# EAGLE design FORCE2_1_3 (EAGLE 9.3.0)
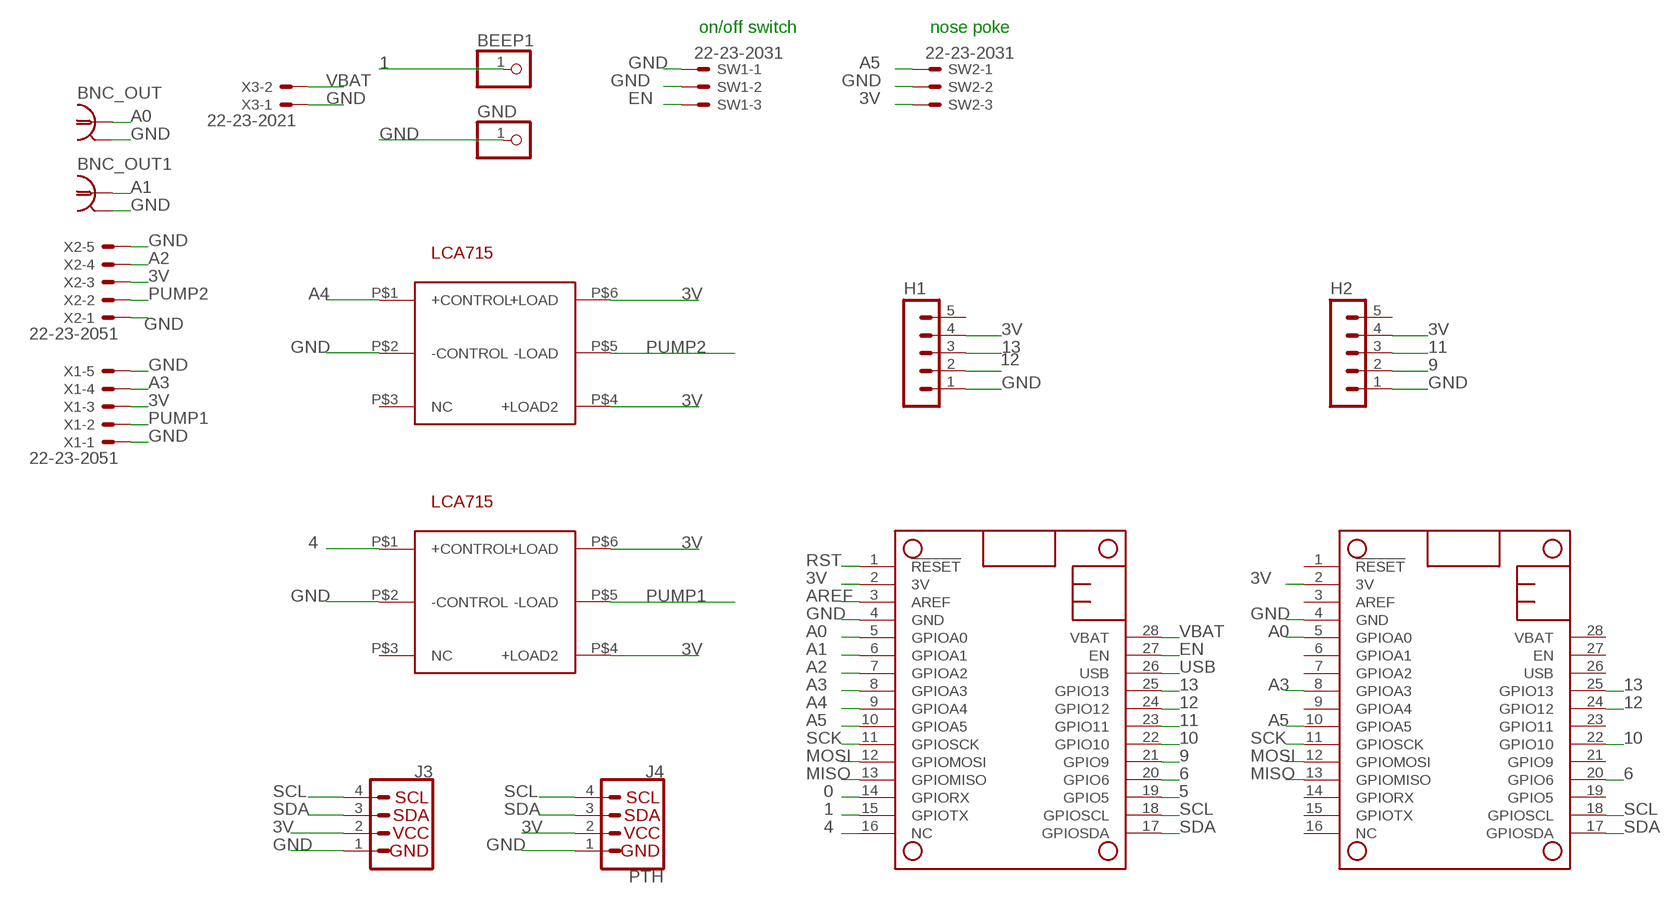
[diagram p0: schematic, sheet 1]

## Parts
BEEP1  PINHD-1X1  [1X01]
BNC_OUT  1-227161-0  [AMP_227161]
BNC_OUT1  1-227161-0  [AMP_227161]
GND  PINHD-1X1  [1X01]
H1  MA05-1  [MA05-1]
H2  MA05-1  [MA05-1]
J3  QWIIC_CONNECTORJS-1MM  [1X04_1MM_RA]
J4  PTH  I2C_STANDARD  [1X04]
MS1  MICROSHIELD_NODIM  [MICROSHIELD_DIM]
MS2  MICROSHIELD_NODIM  [MICROSHIELD_DIM]
SSR2  LCA715S  [LCA7XX]
SSR3  LCA715S  [LCA7XX]
SW1  22-23-2031  [22-23-2031]
SW2  22-23-2031  [22-23-2031]
X1  22-23-2051  [22-23-2051]
X2  22-23-2051  [22-23-2051]
X3  22-23-2021  [22-23-2021]

## Nets
0: MS2.14(GPIORX)
1: BEEP1.1 MS2.15(GPIOTX)
3V: H1.4 H2.4 J3.2 J4.2 MS1.2(3V) MS2.2(3V) SSR2.P$4(+LOAD2) SSR2.P$6(+LOAD) SSR3.P$4(+LOAD2) SSR3.P$6(+LOAD) SW2.3 X1.3 X2.3
4: MS2.16(NC) SSR2.P$1(+CONTROL)
5: MS2.19(GPIO5)
6: MS1.20(GPIO6) MS2.20(GPIO6)
9: H2.2 MS2.21(GPIO9)
10: MS1.22(GPIO10) MS2.22(GPIO10)
11: H2.3 MS2.23(GPIO11)
12: H1.2 MS1.24(GPIO12) MS2.24(GPIO12)
13: H1.3 MS1.25(GPIO13) MS2.25(GPIO13)
A0: BNC_OUT.1 MS1.5(GPIOA0) MS2.5(GPIOA0)
A1: BNC_OUT1.1 MS2.6(GPIOA1)
A2: MS2.7(GPIOA2) X2.4
A3: MS1.8(GPIOA3) MS2.8(GPIOA3) X1.4
A4: MS2.9(GPIOA4) SSR3.P$1(+CONTROL)
A5: MS1.10(GPIOA5) MS2.10(GPIOA5) SW2.1
AREF: MS2.3(AREF)
EN: MS2.27(EN) SW1.3
GND: BNC_OUT1.2 BNC_OUT.2 GND.1 H1.1 H2.1 J3.1 J4.1 MS1.4(GND) MS2.4(GND) SSR2.P$2(-CONTROL) SSR3.P$2(-CONTROL) SW1.1 SW1.2 SW2.2 X1.1 X1.5 X2.1 X2.5 X3.1
MISO: MS1.13(GPIOMISO) MS2.13(GPIOMISO)
MOSI: MS1.12(GPIOMOSI) MS2.12(GPIOMOSI)
PUMP1: SSR2.P$5(-LOAD) X1.2
PUMP2: SSR3.P$5(-LOAD) X2.2
RST: MS2.1(!RESET)
SCK: MS1.11(GPIOSCK) MS2.11(GPIOSCK)
SCL: J3.4 J4.4 MS1.18(GPIOSCL) MS2.18(GPIOSCL)
SDA: J3.3 J4.3 MS1.17(GPIOSDA) MS2.17(GPIOSDA)
USB: MS2.26(USB)
VBAT: MS2.28(VBAT) X3.2
Unconnected: H1.5 H2.5 MS1.1(!RESET) MS1.3(AREF) MS1.6(GPIOA1) MS1.7(GPIOA2) MS1.9(GPIOA4) MS1.14(GPIORX) MS1.15(GPIOTX) MS1.16(NC) MS1.19(GPIO5) MS1.21(GPIO9) MS1.23(GPIO11) MS1.26(USB) MS1.27(EN) MS1.28(VBAT) SSR2.P$3(NC) SSR3.P$3(NC)

## Notes on the sheet
- on/off switch | nose poke

## Library data of the parts
BEEP1 GND = pinhead:PINHD-1X1: PIN HEADER
BNC_OUT BNC_OUT1 = con-coax:?227161*: JACK, RIGHT ANGLE, 50 OHM, PCB, BNC Source: amp_227161.pdf; MF: TYCO ELECTRONICS; MPN: 1-227161; OC_FARNELL: unknown; OC_NEWARK: 33B3200
H1 H2 = con-lstb:MA05-1: PIN HEADER; OC_FARNELL: unknown; OC_NEWARK: unknown
J3 = SparkFun-Connectors:QWIIC_CONNECTOR: SparkFun I2C Standard Qwiic Connector An SMD 1mm pitch JST connector makes it easy and quick (get it? Qwiic?) to connect I2C devices to each other. The Qwiic system <http://www.sparkfun.com/qwiic> enables fast and solderless connection between popular platforms and various sensors and actuators. We carry 200mm <https://www.sparkfun.com/products/14204>, 100mm <https://www.sparkfun.com/products/14205>, 50mm <https://www.sparkfun.com/products/14206>, and breadboard friendly <https://www.sparkfun.com/products/14207> Qwiic cables. We also offer 10 pcs strips <https://www.sparkfun.com/products/14323> the SMD connectors.; PROD_ID: CONN-13694
J4 = SparkFun-Connectors:I2C_STANDARD: SparkFun I2C Standard Pinout Header SparkFun has standardized on a pinout for all I2C based sensor breakouts. This pinout allows I2C boards to be plugged directly into the headers on Arduino Uno compatible boards, and to be daisy chained easily. Example SparkFun Products: SparkFun Atmospheric Sensor Breakout - BME280 <https://www.sparkfun.com/products/13676> SparkFun Altitude/Pressure Sensor Breakout - MPL3115A2 <https://www.sparkfun.com/products/11084> SparkFun TOF Range Finder Sensor - VL6180 <https://www.sparkfun.com/products/12785>
MS1 MS2 = M4:MICROSHIELD
SSR2 SSR3 = Mohamed's-library:LCA715S
SW1 SW2 = con-molex:22-23-2031: .100" (2.54mm) Center Header - 3 Pin; MF: MOLEX; MPN: 22-23-2031; OC_FARNELL: 1462950; OC_NEWARK: 30C0862
X1 X2 = con-molex:22-23-2051: .100" (2.54mm) Center Header - 5 Pin; MF: MOLEX; MPN: 22-23-2051; OC_FARNELL: 1462952; OC_NEWARK: 38C9178
X3 = con-molex:22-23-2021: .100" (2.54mm) Center Header - 2 Pin; MF: MOLEX; MPN: 22-23-2021; OC_FARNELL: 1462926; OC_NEWARK: 25C3832

## Board
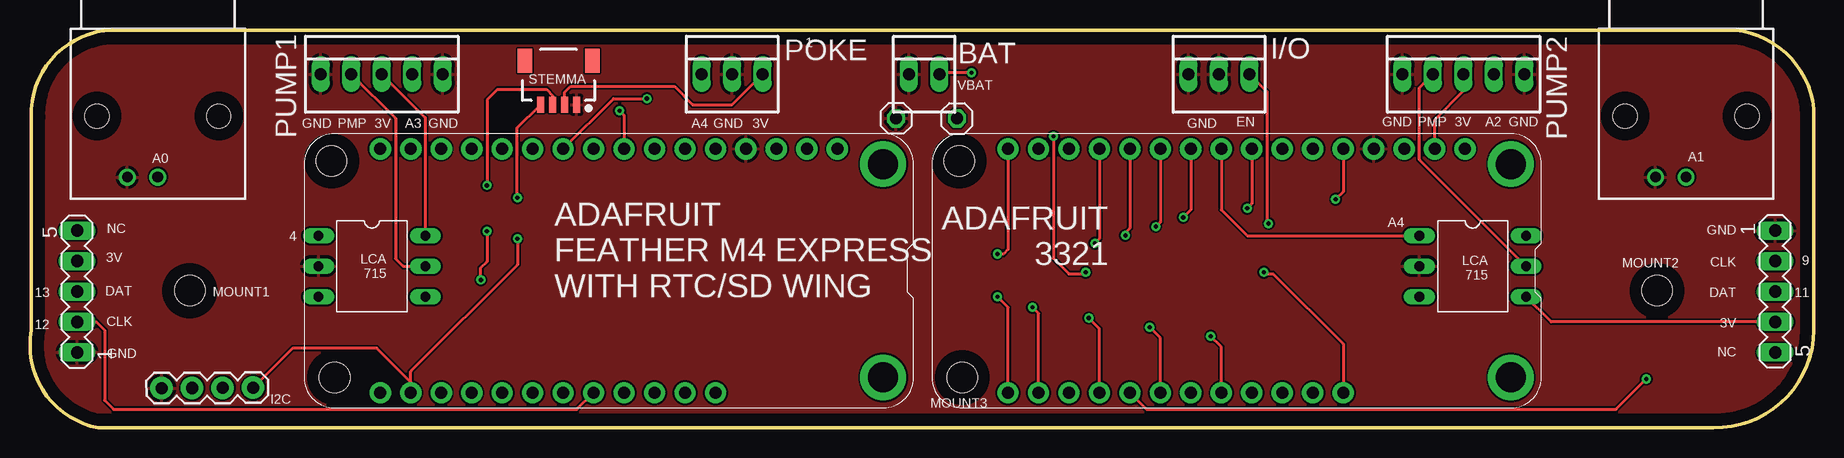
[diagram p1: board, top side]
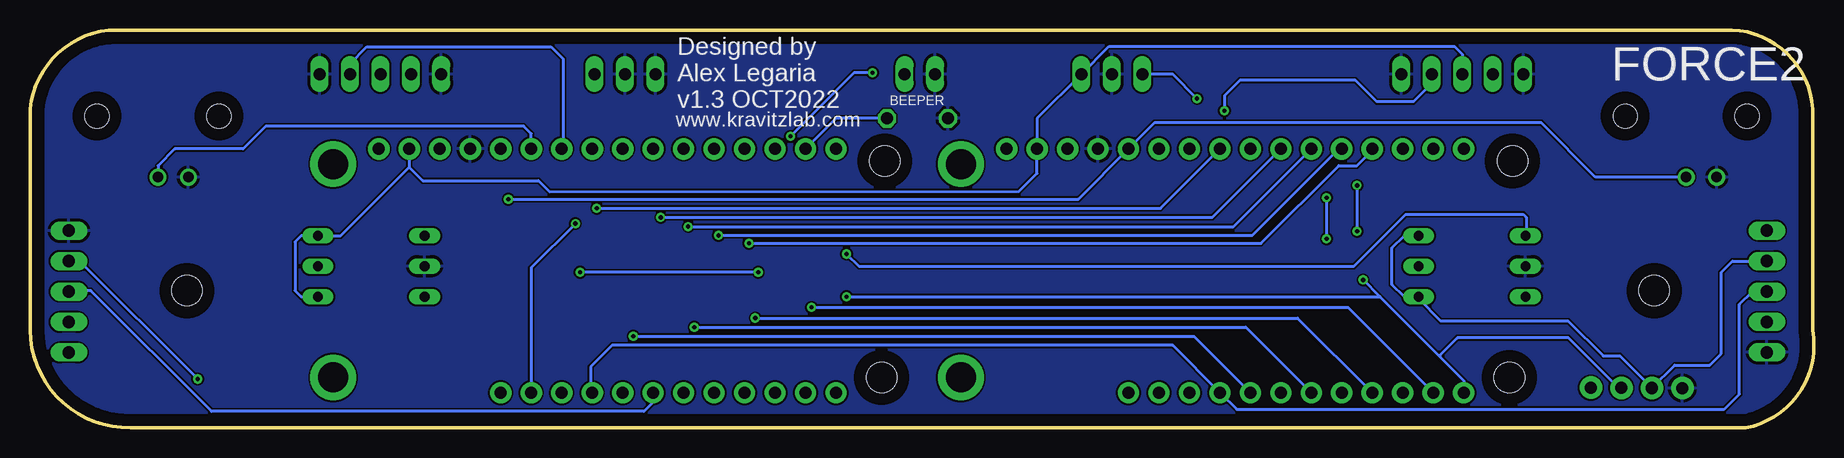
[diagram p2: board, bottom side, seen from below]

Size 148.71 x 33.15 mm. Coordinates in mm from the lower left corner, seen from the top.
Outline: 6.85,33.15 141.47,33.15 arc-90 148.71,25.91 148.71,8.13 arc-90 140.32,0 5.7,0 arc-90 0.12,8.13 0.12,25.91 arc-90 6.85,33.15
Copper layers (1*16): Top 0.035mm / dielectric 1.5mm / Bottom 0.035mm
Design rules "default": minimum track width 6mil, minimum drill 0.35mm, track to track 6mil, track to pad 6mil, pad to pad 6mil, via to via 6mil, smd to smd 6mil, copper to edge 40mil, drill to drill 6mil, minimum pad ring 10mil, minimum via ring 8mil, stop-mask expansion 4mil, vias tented up to drill 0mil, thermal gap 10mil
Holes 2.54 mm at 13.32,11.43 135.63,11.43

### Footprints (pad centres in the part's own frame; a part is rotated, then mirrored left to right if it is on the bottom)
1X01 = drill 1.016 octagon: 1 0,0
AMP_227161 = drill 0.9 pad 1.27: 1 0,-5.08; 2 -2.54,-5.08 | hole 2: -5.08,0; 5.08,0
MA05-1 = drill 1.016 long: 1 -5.08,0; 2 -2.54,0; 3 0,0; 4 2.54,0; 5 5.08,0
1X04_1MM_RA = smd 0.6 x 1.35: 1 -1.5,0; 2 -0.5,0; 3 0.5,0; 4 1.5,0 | smd 1.2 x 2: NC1 2.8,-3.675; NC2 -2.8,-3.675
1X04 = drill 1.016 pad 1.88: 1 0,0; 2 2.54,0; 3 5.08,0; 4 7.62,0
MICROSHIELD_DIM = drill 1 pad 1.778: 1 6.35,1.27; 2 8.89,1.27; 3 11.43,1.27; 4 13.97,1.27; 5 16.51,1.27; 6 19.05,1.27; 7 21.59,1.27; 8 24.13,1.27; 9 26.67,1.27; 10 29.21,1.27; 11 31.75,1.27; 12 34.29,1.27; 13 36.83,1.27; 14 39.37,1.27; 15 41.91,1.27; 16 44.45,1.27; 17 44.45,21.59; 18 41.91,21.59; 19 39.37,21.59; 20 36.83,21.59; 21 34.29,21.59; 22 31.75,21.59; 23 29.21,21.59; 24 26.67,21.59; 25 24.13,21.59; 26 21.59,21.59; 27 19.05,21.59; 28 16.51,21.59 | drill 2.5 pad 3.81: P$1 2.54,20.32; P$2 2.54,2.54 | hole 2.54: 48.26,20.32; 48.514,2.286
LCA7XX = drill 0.8 long: P$1 -5.08,2.54; P$2 -5.08,0; P$3 -5.08,-2.54; P$4 3.81,-2.54; P$5 3.81,0; P$6 3.81,2.54
22-23-2031 = drill 1 long: 1 -2.54,0; 2 0,0; 3 2.54,0
22-23-2051 = drill 1 long: 1 -5.08,0; 2 -2.54,0; 3 0,0; 4 2.54,0; 5 5.08,0
22-23-2021 = drill 1 long: 1 -1.27,0; 2 1.27,0

### Placement (x,y rotation side)
BEEP1  77.27,25.78 90 top
BNC_OUT  10.66,25.97 0 top
BNC_OUT1  138.04,25.97 0 top
GND  72.19,25.78 270 top
H1  3.93,11.35 90 top
H2  145.47,11.35 270 top
J3  44.06,26.92 180 top
J4  10.98,3.3 0.3 top
MS1  73.65,24.51 180 top
MS2  125.97,24.51 180 top
SSR2  29.14,13.46 0 top
SSR3  120.89,13.46 0 top
SW1  99.11,29.46 0 top
SW2  58.54,29.46 0 top
X1  29.33,29.46 0 top
X2  119.5,29.46 0 top
X3  74.54,29.46 0 top

### Tracks (layer width: path | path; a pad name or v marks a point on that pad's centre or on a via)
1
  Bottom 0.254: MS2.15 81.52,25.78 BEEP1.1
3V
  Top 0.254: X1.3 32.95,25.84 SSR2.P$6 | J3.2 44.56,27.94 45.07,28.45 53.71,28.45 55.23,26.92 58.54,26.92 SW2.3 | H2.4 126.81,8.81 SSR3.P$4 | MS2.2 117.08,25.65 119.5,28.07 X2.3
  Bottom 0.254: H1.4 6.8,13.89 7.74,12.95 7.74,6.17 8.69,5.22 11.61,5.22 J4.2 16.18,5.98 17.58,5.98 20.49,8.89 31.1,8.89 32.95,10.73 SSR2.P$4 34.15,10.92 35.17,11.94 35.17,14.99 34.15,16 SSR2.P$6 | MS2.2 117.08,21.72 | 117.08,21.72 115.97,20.6 106.31,20.6 105.4,19.68 66.26,19.71 64.76,21.21 MS1.2 64.76,25.78 SW2.3 58.77,31.78 29.96,31.78 29.33,31.14 X1.3 | SSR3.P$4 126.1,10.92 126.61,11.43 126.61,15.49 126.1,16 SSR3.P$6 122.8,16 117.08,21.72
4  (via drill 0.35)
  Top 0.254: MS2.16 81.52,14.86 81.14,14.48 v80.63,14.48
  Bottom 0.254: v80.63,14.48 79.62,13.46 38.34,13.46 34.03,17.78 24.25,17.78 23.99,17.53 23.99,16.07 SSR2.P$1
6  (via drill 0.35)
  Top 0.254: MS2.20 89.14,8.26 v88.25,9.14
  Bottom 0.254: v88.25,9.14 43.04,9.14 MS1.20
9  (via drill 0.35)
  Top 0.254: MS2.21 93.08,1.52 132.2,1.52 v134.74,4.06
  Bottom 0.254: v134.74,4.06 144.64,13.97 145.39,13.97 H2.2
10  (via drill 0.35)
  Top 0.254: MS2.22 94.22,7.49 v93.33,8.38
  Bottom 0.254: v93.33,8.38 47.36,8.38 MS1.22
11
  Bottom 0.254: MS2.23 96.76,2.13 97.53,1.37 133.57,1.37 143.63,11.43 145.39,11.43 H2.3
12  (via drill 0.35)
  Top 0.254: MS2.24 99.3,6.73 v98.41,7.62 | H1.2 5.53,8.81 6.21,8.13 6.21,2.29 6.97,1.52 45.58,1.52 MS1.24
  Bottom 0.254: v98.41,7.62 51.68,7.62 MS1.24
13
  Bottom 0.254: MS2.25 101.97,3.05 101.97,5.08 100.19,6.86 53.46,6.86 MS1.25 48.12,1.52 7.48,1.52 6.21,2.79 6.21,10.29 5.15,11.35 H1.3
A0  (via drill 0.35)
  Top 0.254: MS2.5 109.46,19.68 v108.83,19.05
  Bottom 0.254: v108.83,19.05 61.33,19.05 MS1.5 54.98,25.4 22.72,25.4 18.21,20.89 BNC_OUT.1
A1
  Bottom 0.254: MS2.6 106.92,24.51 107.56,25.15 129.05,25.15 130.95,23.24 136.64,23.24 138.04,21.84 BNC_OUT1.1
A2
  Bottom 0.254: X2.4 122.04,30.35 120.64,31.75 105.27,31.75 104.26,30.73 104.26,23.37 MS2.7
A3  (via drill 0.35)
  Top 0.254: MS2.8 101.84,18.67 v101.46,18.29 | v49.14,26.42 49.52,26.04 MS1.8
  Bottom 0.254: MS1.8 54.47,18.29 v101.46,18.29 | X1.4 31.87,28.7 33.39,27.18 36.44,27.18 38.22,28.96 47.87,28.96 49.14,27.69 v49.14,26.42
A4
  Top 0.254: MS2.9 99.3,18.16 101.46,16 SSR3.P$1
A5  (via drill 0.35)
  Top 0.254: MS2.10 96.76,18.16 v96.13,17.53 | MS1.10 48.63,27.43 v51.42,27.43
  Bottom 0.254: v96.13,17.53 50.15,17.53 MS1.10 | v51.42,27.43 53.46,29.46 SW2.1
EN  (via drill 0.35)
  Top 0.254: SW1.3 103.11,28 103.11,17.14 v103.24,17.02
  Bottom 0.254: v103.24,17.02 106.92,13.34 MS2.27
GND
  pour Bottom: -0.65,36.07 148.71,36.07 154.55,30.23 154.55,1.78 148.2,-4.57 0.88,-4.57 -3.69,0
  pour Top: 0.12,40.89 152.01,40.89 160.64,32.26 160.64,7.62 147.44,-5.59 0.37,-5.59 -5.22,0 -5.22,35.56
MISO  (via drill 0.35)
  Top 0.254: MS2.13 89.14,15.75 v88.76,15.37
  Bottom 0.254: v88.76,15.37 46.09,15.37 39.61,21.84 38.09,21.84 36.82,23.11 MS1.13
MOSI  (via drill 0.35)
  Top 0.254: MS2.12 91.68,16.64 91.3,16.26 v91.3,16.03
  Bottom 0.254: v91.3,16.03 46.82,16.03 39.61,23.24 MS1.12
PUMP1
  Top 0.254: X1.2 30.47,25.78 30.47,14.1 31.1,13.46 SSR2.P$5
PUMP2
  Top 0.254: X2.2 115.81,28.32 115.81,22.35 SSR3.P$5
SCK  (via drill 0.35)
  Top 0.254: MS2.11 94.22,17.14 v93.84,16.76
  Bottom 0.254: v93.84,16.76 48.38,16.76 MS1.11
SCL  (via drill 0.35)
  Top 0.254: MS2.18 84.06,9.53 v83.56,10.03 | J3.4 40.58,24.94 40.58,19.18 v40.63,19.18 | J4.4 21.9,6.64 28.91,6.64 31.74,3.81 MS1.18 31.74,4.7 40.63,13.59 v40.63,15.75
  Bottom 0.254: v83.56,10.03 38.85,10.03 MS1.18 | v40.63,19.18 v40.63,15.75
SDA  (via drill 0.35)
  Top 0.254: MS2.17 81.52,10.03 v80.63,10.92 | J3.3 43.56,27.68 43.04,28.19 38.98,28.19 38.11,27.33 38.11,20.22 v38.09,20.19 | v37.58,12.32 37.58,13.34 38.09,13.84 | 38.09,13.84 38.11,13.87 | v38.09,16.38 38.09,13.84
  Bottom 0.254: v80.63,10.92 36.18,10.92 | 36.18,10.92 31.17,5.91 | 31.17,5.91 29.2,3.94 MS1.17 | 36.18,10.92 v37.58,12.32 | v37.58,12.32 | J4.3 16.31,3.33 20.47,7.49 29.71,7.49 31.17,6.03 31.17,5.91 | v38.09,20.19 v38.09,16.38
VBAT  (via drill 0.35)
  Top 0.254: v85.31,24.28 85.31,14.12 86.6,12.83 87.87,12.83 v88,12.95 | MS2.28 109.46,6.99 103.62,12.83 102.99,12.83 v102.86,12.95 | v78.48,29.59 75.94,29.59 X3.2
  Bottom 0.254: v78.48,29.59 80,29.59 v85.31,24.28 | v88,12.95 v102.86,12.95

### Text on the board
tNames: 1 | POKE | BAT | I/O | STEMMA | VBAT | GND | PMP | 3V | A3 | GND | A4 | GND | 3V | GND | EN | GND | PMP | 3V | A2 | GND | PUMP1 | PUMP2 | A0 | A1 | A4 | NC | 4 | GND | 3V | LCA / 715 | LCA / 715 | 9 | MOUNT2 | CLK | 13 | DAT | DAT | 11 | MOUNT1 | ADAFRUIT / 3321 | CLK | 12 | 3V | ADAFRUIT / FEATHER M4 EXPRESS / WITH RTC/SD WING | GND | NC | I2C | MOUNT3
bNames: FORCE2 | BEEPER | Designed by / Alex Legaria / v1.3 OCT2022 | www.kravitzlab.com